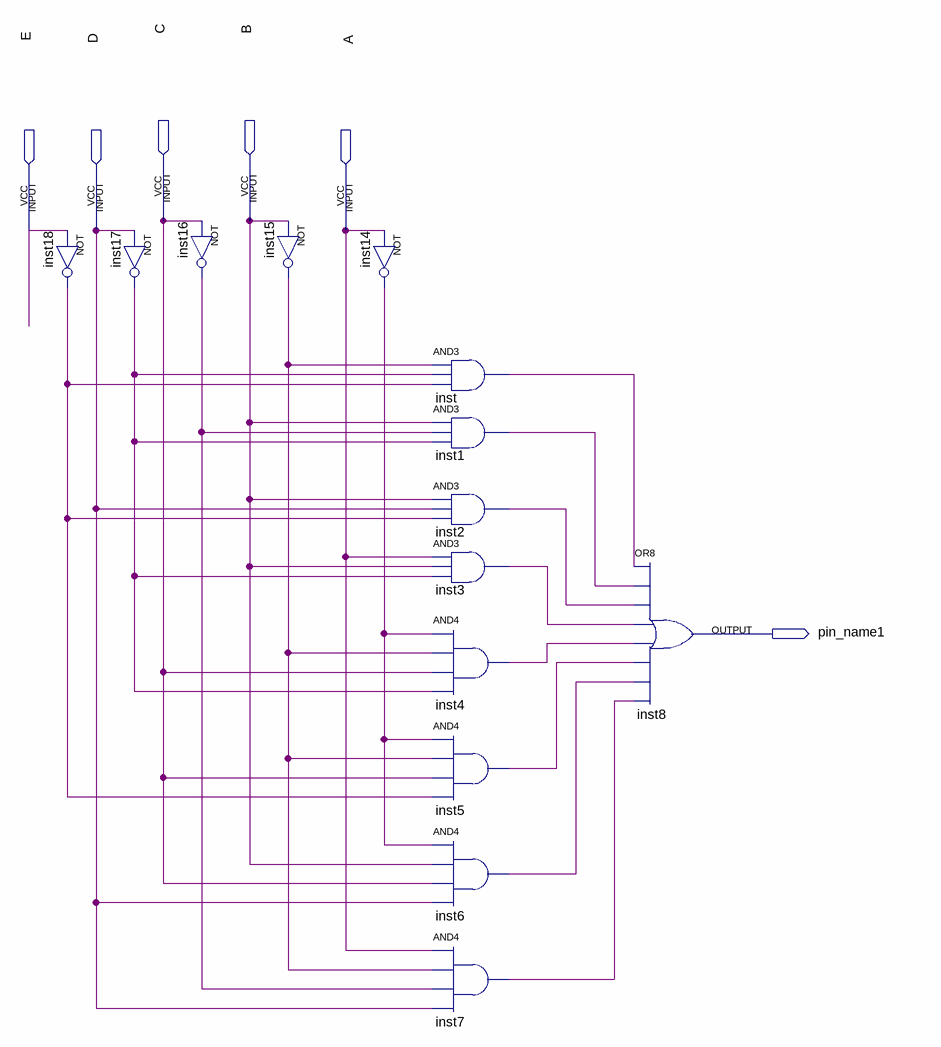
[diagram p0: schematic sheet]
// Quartus schematic decod2-6.bdf as structural Verilog: 14 symbols, 6 pins
module \decod2-6  (
  input  C,
  input  B,
  input  E,
  input  D,
  input  A,
  output pin_name1
);

  wire inst1_out, inst2_out, inst3_out, inst4_out, inst5_out, inst6_out, inst7_out, inst14_out, inst15_out,
       inst16_out, inst17_out, inst18_out, inst_out;

  not inst18 (inst18_out, E);
  not inst17 (inst17_out, D);
  not inst16 (inst16_out, C);
  not inst15 (inst15_out, B);
  not inst14 (inst14_out, A);
  and inst (inst_out, inst15_out, inst17_out, inst18_out);
  and inst1 (inst1_out, B, inst16_out, inst17_out);
  and inst2 (inst2_out, B, D, inst18_out);
  and inst3 (inst3_out, A, B, inst17_out);
  and inst4 (inst4_out, inst14_out, inst15_out, C, inst17_out);
  and inst5 (inst5_out, inst14_out, inst15_out, C, inst18_out);
  and inst6 (inst6_out, inst14_out, B, C, D);
  and inst7 (inst7_out, A, inst15_out, inst16_out, D);
  or inst8 (pin_name1, inst_out, inst1_out, inst2_out, inst3_out, inst4_out, inst5_out, inst6_out, inst7_out);
endmodule
